# EAGLE design lighting_ctl_ft245 (EAGLE 5.12)
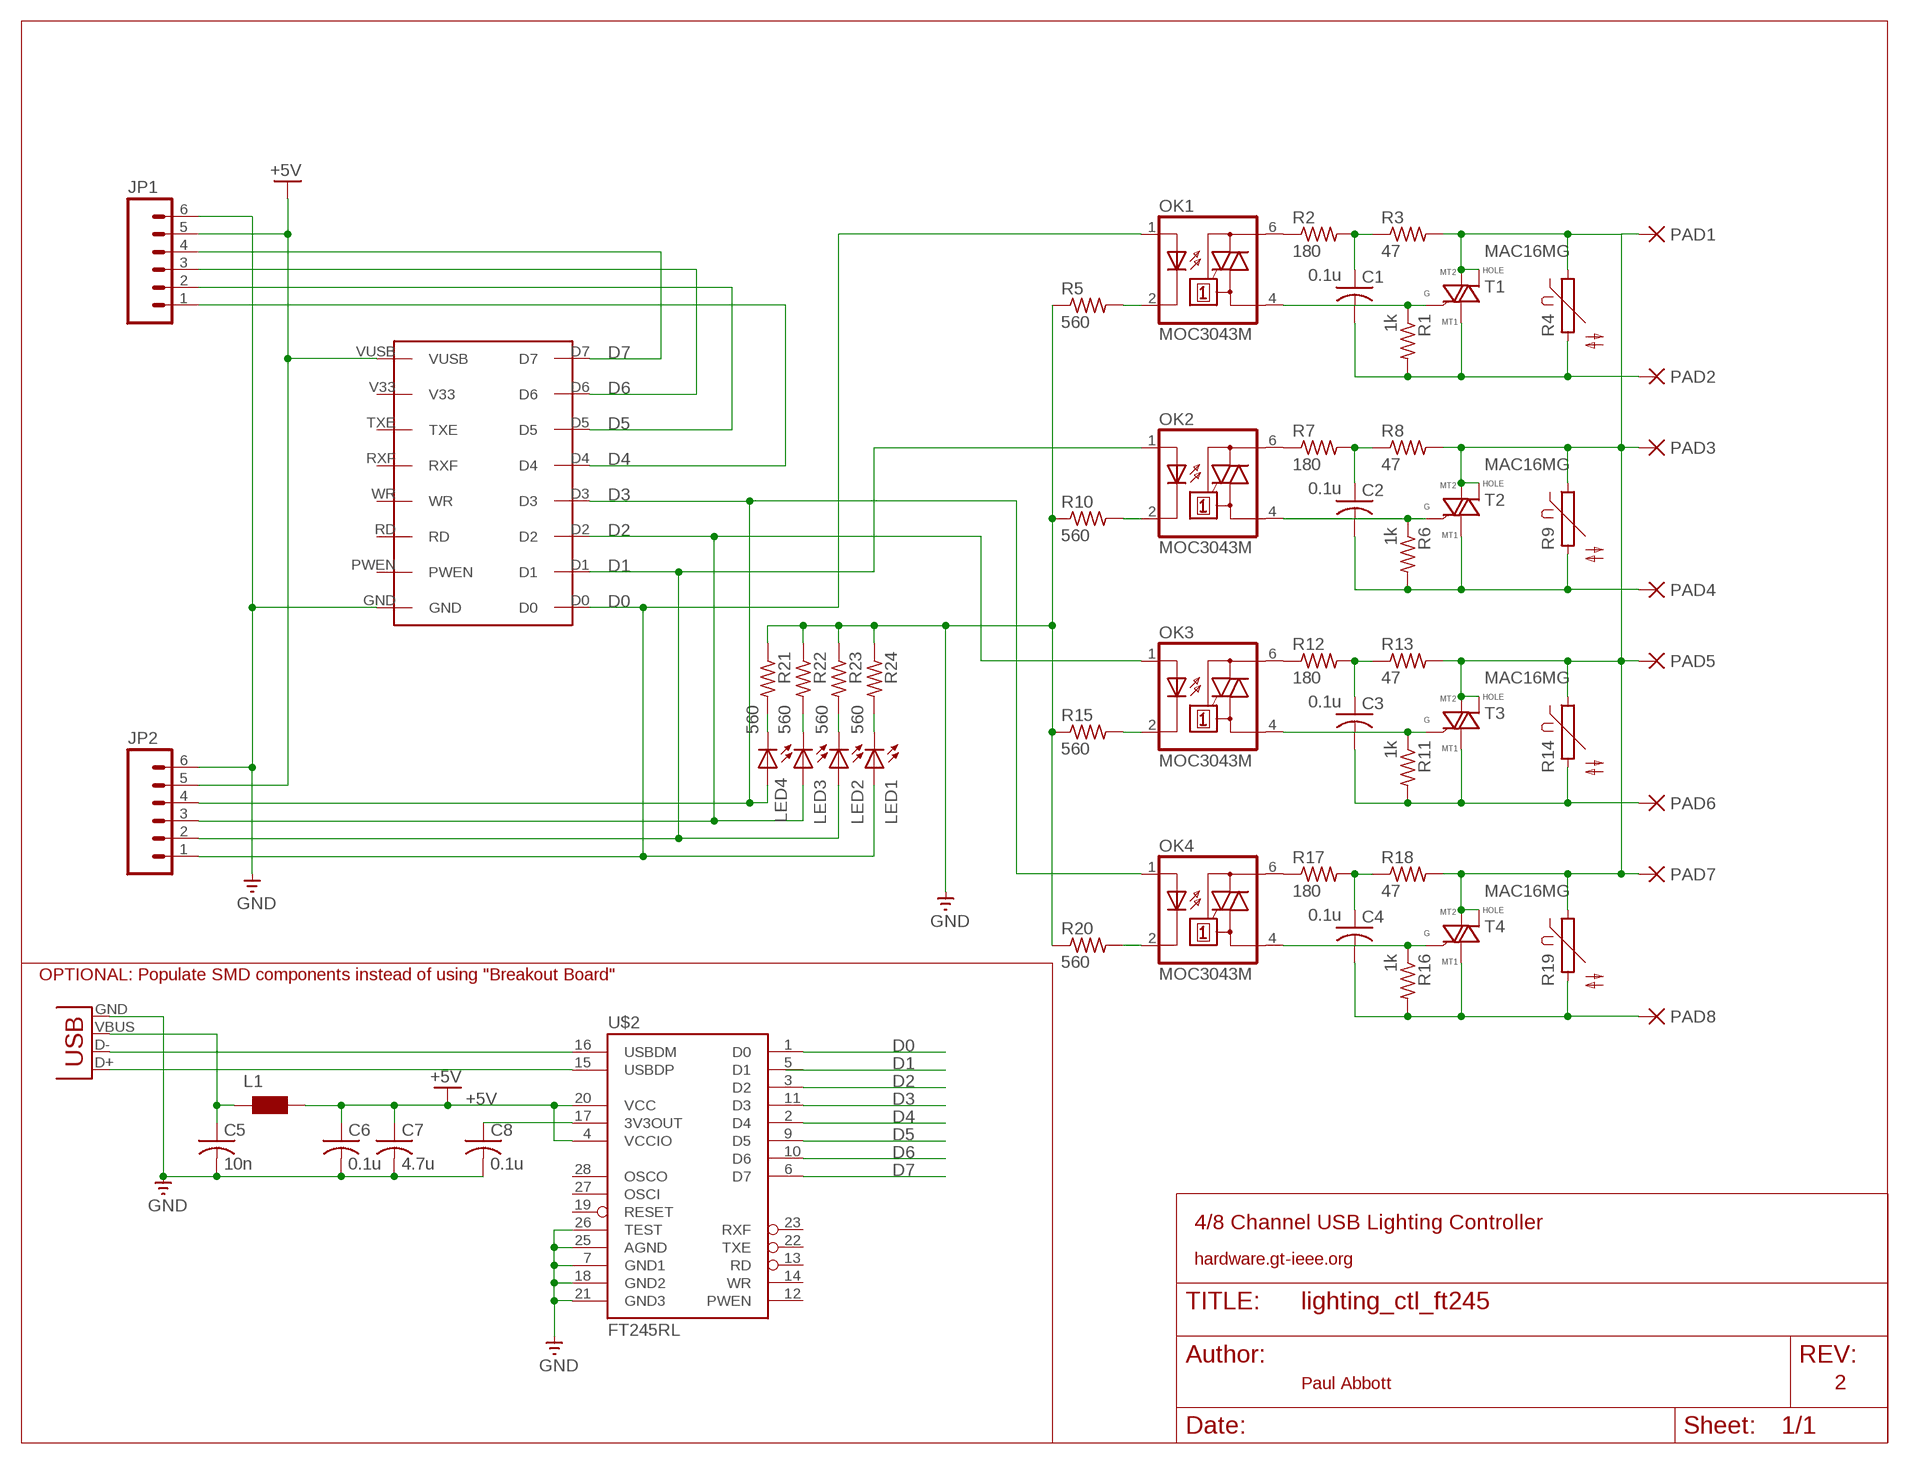
[diagram p0: schematic, sheet 1]

## Parts
C1  0.1u  C-US075-032X103  [C075-032X103]
C2  0.1u  C-US075-032X103  [C075-032X103]
C3  0.1u  C-US075-032X103  [C075-032X103]
C4  0.1u  C-US075-032X103  [C075-032X103]
C5  10n  C-USC0603  [C0603]
C6  0.1u  C-USC0603  [C0603]
C7  4.7u  C-USC1206  [C1206]
C8  0.1u  C-USC0603  [C0603]
FRAME2  LETTER_L  [LETTER_L]
JP1  M06LOCK  [1X06_LOCK]
JP2  M06LOCK  [1X06_LOCK]
L1  WE-CBF_0805  [0805]
LED1  LED3MM  [LED3MM]
LED2  LED3MM  [LED3MM]
LED3  LED3MM  [LED3MM]
LED4  LED3MM  [LED3MM]
OK1  MOC3043M  MOC3010M  [DIL06]
OK2  MOC3043M  MOC3010M  [DIL06]
OK3  MOC3043M  MOC3010M  [DIL06]
OK4  MOC3043M  MOC3010M  [DIL06]
PAD1  PAD-0820  [0820]
PAD2  PAD-0820  [0820]
PAD3  PAD-0820  [0820]
PAD4  PAD-0820  [0820]
PAD5  PAD-0820  [0820]
PAD6  PAD-0820  [0820]
PAD7  PAD-0820  [0820]
PAD8  PAD-0820  [0820]
R1  1k  R-US_0613/5V  [P0613V]
R2  180  R-US_0613/5V  [P0613V]
R3  47  R-US_0613/5V  [P0613V]
R4  P595  [P595]
R5  560  R-US_0613/5V  [P0613V]
R6  1k  R-US_0613/5V  [P0613V]
R7  180  R-US_0613/5V  [P0613V]
R8  47  R-US_0613/5V  [P0613V]
R9  P595  [P595]
R10  560  R-US_0613/5V  [P0613V]
R11  1k  R-US_0613/5V  [P0613V]
R12  180  R-US_0613/5V  [P0613V]
R13  47  R-US_0613/5V  [P0613V]
R14  P595  [P595]
R15  560  R-US_0613/5V  [P0613V]
R16  1k  R-US_0613/5V  [P0613V]
R17  180  R-US_0613/5V  [P0613V]
R18  47  R-US_0613/5V  [P0613V]
R19  P595  [P595]
R20  560  R-US_0613/5V  [P0613V]
R21  560  R-US_0613/5V  [P0613V]
R22  560  R-US_0613/5V  [P0613V]
R23  560  R-US_0613/5V  [P0613V]
R24  560  R-US_0613/5V  [P0613V]
T1  MAC16MG  BT138  [TO220BH]
T2  MAC16MG  BT138  [TO220BH]
T3  MAC16MG  BT138  [TO220BH]
T4  MAC16MG  BT138  [TO220BH]
U$1  FT245BREAKOUT  [FT245BREAKOUT]
U$2  FT245RL  [SSOP28DB]
X1  USBSMD  [USB-MINIB]

## Nets
+5V [5V]: C6.1 C7.1 JP1.5 JP2.5 L1.2 U$1.VUSB U$2.4(VCCIO) U$2.20(VCC)
D0 [data]: JP2.1 LED1.A OK1.1(A) U$1.D0 U$2.1(D0)
D1 [data]: JP2.2 LED2.A OK2.1(A) U$1.D1 U$2.5(D1)
D2 [data]: JP2.3 LED3.A OK3.1(A) U$1.D2 U$2.3(D2)
D3 [data]: JP2.4 LED4.A OK4.1(A) U$1.D3 U$2.11(D3)
D4 [data]: JP1.1 U$1.D4 U$2.2(D4)
D5 [data]: JP1.2 U$1.D5 U$2.9(D5)
D6 [data]: JP1.3 U$1.D6 U$2.10(D6)
D7 [data]: JP1.4 U$1.D7 U$2.6(D7)
GND [5V]: C5.2 C6.2 C7.2 C8.2 JP1.6 JP2.6 R5.1 R10.1 R15.1 R20.1 R21.1 R22.1 R23.1 R24.1 U$1.GND U$2.7(GND1) U$2.18(GND2) U$2.21(GND3) U$2.25(AGND) U$2.26(TEST) X1.GND
L1_COMM [power]: PAD1.P$1(P) PAD3.P$1(P) PAD5.P$1(P) PAD7.P$1(P) R3.2 R4.1 R8.2 R9.1 R13.2 R14.1 R18.2 R19.1 T1.HOLE T1.T2(A2) T2.HOLE T2.T2(A2) T3.HOLE T3.T2(A2) T4.HOLE T4.T2(A2)
N$1 [power]: C1.2 PAD2.P$1(P) R1.2 R4.2 T1.T1(A1)
N$2: OK1.4(A1) R1.1 T1.G
N$3: OK1.6(A2) R2.1
N$4 [power]: C2.2 PAD4.P$1(P) R6.2 R9.2 T2.T1(A1)
N$5 [data]: U$2.15(USBDP) X1.D+
N$6: C1.1 R2.2 R3.1
N$7 [data]: U$2.16(USBDM) X1.D-
N$8: OK1.2(C) R5.2
N$9: OK2.4(A1) R6.1 T2.G
N$10: OK2.6(A2) R7.1
N$11: LED1.K(C) R24.2
N$12: C2.1 R7.2 R8.1
N$13: OK2.2(C) R10.2
N$14: LED2.K(C) R23.2
N$15 [power]: C3.2 PAD6.P$1(P) R11.2 R14.2 T3.T1(A1)
N$16: OK3.4(A1) R11.1 T3.G
N$17: OK3.6(A2) R12.1
N$18: C8.1 U$2.17(3V3OUT)
N$19: C3.1 R12.2 R13.1
N$20: OK3.2(C) R15.2
N$21 [power]: C4.2 PAD8.P$1(P) R16.2 R19.2 T4.T1(A1)
N$22: OK4.4(A1) R16.1 T4.G
N$23: OK4.6(A2) R17.1
N$24: LED3.K(C) R22.2
N$25: C4.1 R17.2 R18.1
N$26: OK4.2(C) R20.2
N$27: LED4.K(C) R21.2
N$28 [5V]: C5.1 L1.1 X1.VBUS
Unconnected: U$1.PWEN U$1.RD U$1.RXF U$1.TXE U$1.V33 U$1.WR U$2.12(PWEN) U$2.13(RD) U$2.14(WR) U$2.19(RESET) U$2.22(TXE) U$2.23(RXF) U$2.27(OSCI) U$2.28(OSCO)

## Notes on the sheet
- OPTIONAL: Populate SMD components instead of using "Breakout Board"
- 4/8 Channel USB Lighting Controller
- hardware.gt-ieee.org
- Paul Abbott | 2

## Library data of the parts
C1-C8 = rcl:C-US: CAPACITOR, American symbol
FRAME2 = FRAME:LETTER_L: FRAME LETTER landscape
JP1 JP2 = SparkFun:M06: Header 6 Standard 6-pin 0.1" header. Use with straight break away headers (SKU : PRT-00116), right angle break away headers (PRT-00553), swiss pins (PRT-00743), machine pins (PRT-00117), and female headers (PRT-00115). Molex polarized connector foot print use with SKU : PRT-08094 with associated crimp pins and housings. NOTES ON THE VARIANTS LOCK and LOCK_LONGPADS... This footprint was designed to help hold the alignment of a through-hole component (i.e. 6-pin header) while soldering it into place. You may notice that each hole has been shifted either up or down by 0.005 of an inch from it's more standard position (which is a perfectly straight line). This slight alteration caused the pins (the squares in the middle) to touch the edges of the holes. Because they are alternating, it causes a "brace" to hold the component in place. 0.005 has proven to be the perfect amount of "off-center" position when using our standard breakaway headers. Although looks a little odd when you look at the bare footprint, once you have a header in there, the alteration is very hard to notice. Also, if you push a header all the way into place, it is covered up entirely on the bottom side. This idea of altering the position of holes to aid alignment will be further integrated into the Sparkfun Library for other footprints. It can help hold any component with 3 or more connection pins.
L1 = wuerth-elektronik:WE-CBF: SMD EMI Suppression Ferrite Beads - excellent anti-EMI properties - low DCR - impedances till 3000 ohms - rated current up to 6 A
LED1-LED4 = led:LED: LED OSRAM: - CHIPLED LG R971, LG N971, LY N971, LG Q971, LY Q971, LO R971, LY R971 LH N974, LH R974 LS Q976, LO Q976, LY Q976 LO Q996 - Hyper CHIPLED LW Q18S LB Q993, LB Q99A, LB R99A - SideLED LS A670, LO A670, LY A670, LG A670, LP A670 LB A673, LV A673, LT A673, LW A673 LH A674 LY A675 LS A676, LA A676, LO A676, LY A676, LW A676 LS A679, LY A679, LG A679 - Hyper Micro SIDELED® LS Y876, LA Y876, LO Y876, LY Y876 LT Y87S - SmartLED LW L88C, LW L88S LB L89C, LB L89S, LG L890 LS L89K, LO L89K, LY L89K LS L896, LA L896, LO L896, LY L896 - TOPLED LS T670, LO T670, LY T670, LG T670, LP T670 LSG T670, LSP T670, LSY T670, LOP T670, LYG T670 LG T671, LOG T671, LSG T671 LB T673, LV T673, LT T673, LW T673 LH T674 LS T676, LA T676, LO T676, LY T676, LB T676, LH T676, LSB T676, LW T676 LB T67C, LV T67C, LT T67C, LS T67K, LO T67K, LY T67K, LW E67C LS E67B, LA E67B, LO E67B, LY E67B, LB E67C, LV E67C, LT E67C LW T67C LS T679, LY T679, LG T679 LS T770, LO T770, LY T770, LG T770, LP T770 LB T773, LV T773, LT T773, LW T773 LH T774 LS E675, LA E675, LY E675, LS T675 LS T776, LA T776, LO T776, LY T776, LB T776 LHGB T686 LT T68C, LB T68C - Hyper Mini TOPLED® LB M676 - Mini TOPLED Santana® LG M470 LS M47K, LO M47K, LY M47K Source: http://www.osram.convergy.de - LUMILED® LXK2-PW12-R00, LXK2-PW12-S00, LXK2-PW14-U00, LXK2-PW14-V00 LXK2-PM12-R00, LXK2-PM12-S00, LXK2-PM14-U00 LXK2-PE12-Q00, LXK2-PE12-R00, LXK2-PE12-S00, LXK2-PE14-T00, LXK2-PE14-U00 LXK2-PB12-K00, LXK2-PB12-L00, LXK2-PB12-M00, LXK2-PB14-N00, LXK2-PB14-P00, LXK2-PB14-Q00 LXK2-PR12-L00, LXK2-PR12-M00, LXK2-PR14-Q00, LXK2-PR14-R00 LXK2-PD12-Q00, LXK2-PD12-R00, LXK2-PD12-S00 LXK2-PH12-R00, LXK2-PH12-S00 LXK2-PL12-P00, LXK2-PL12-Q00, LXK2-PL12-R00 Source: www.luxeon.com
OK1-OK4 = optocoupler:MOC30*M: RANDOM-PHASE OPTOISOLATORS TRIAC DRIVER OUTPUT Source: http://www.fairchildsemi.com MOC3020-M.pdf
PAD1-PAD8 = dpads:PAD: WIRE PAD Standard US Drill Sizes and SMD pads
R1-R3 R5-R8 R10-R13 R15-R18 R20-R24 = rcl:R-US_: RESISTOR, American symbol
R4 R9 R14 R19 = varistor:P595: VARISTOR
T1-T4 = GT-IEEE:BT138: TRIAC Source: http://www.semiconductors.philips.com BT138_SERIES_2.pdf
U$1 = lighting_ctl_ft245:FT245BREAKOUT
U$2 = lighting_ctl_ft245:FT245RL: USB FIFO Controller 4th Generation USB Controller (USB <-> Parallel) - FIFO. Spark Fun Electronics SKU : COM-00787
X1 = lighting_ctl_ft245:USB: USB Connectors USB-B-PTH is fully proven SKU : PRT-00139 USB-miniB is fully proven SKU : PRT-00587 USB-A-PCB is untested. USB-A-H is throughly reviewed, but untested. Spark Fun Electronics SKU : PRT-00437 USB-B-SMT is throughly reviewed, but untested. Needs silkscreen touching up. USB-A-S has not been used/tested USB-MB-H has not been used/tested

## Net classes
0 default: width 0.406 mm, drill 0.584 mm, clearance 0.406 mm
1 power: width 0.813 mm, drill 0.584 mm, clearance 0.61 mm
2 data: width 0.254 mm, drill 0.381 mm, clearance 0.254 mm
3 5V: width 0.305 mm, drill 0.584 mm, clearance 0.305 mm

## Board
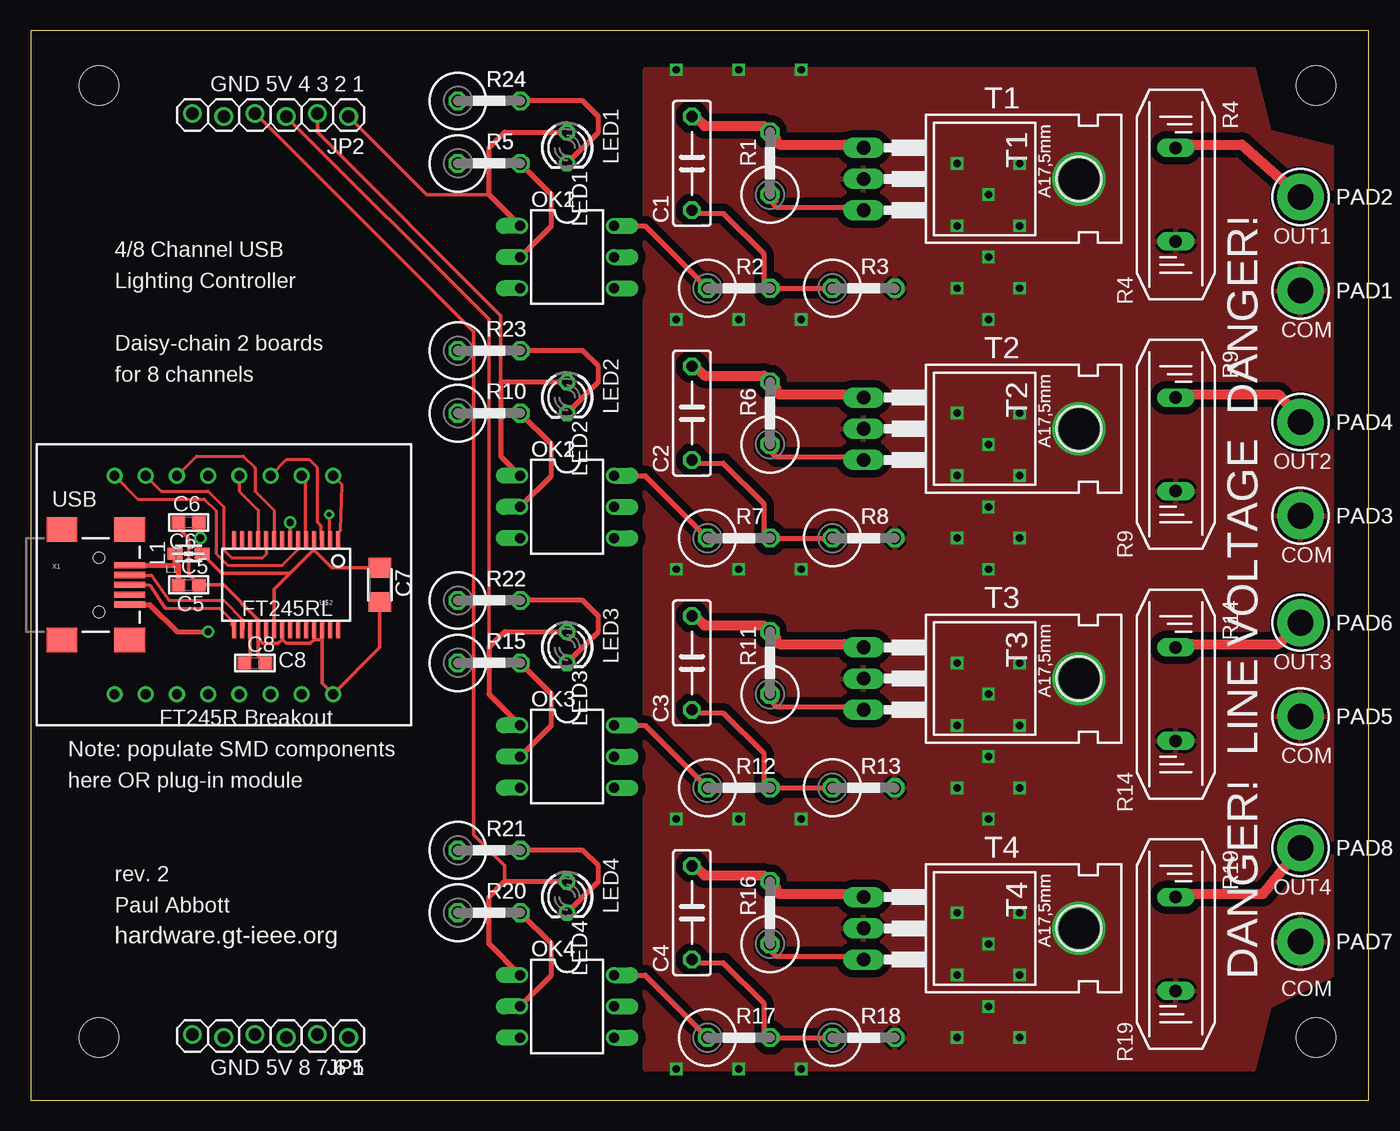
[diagram p1: board, top side]
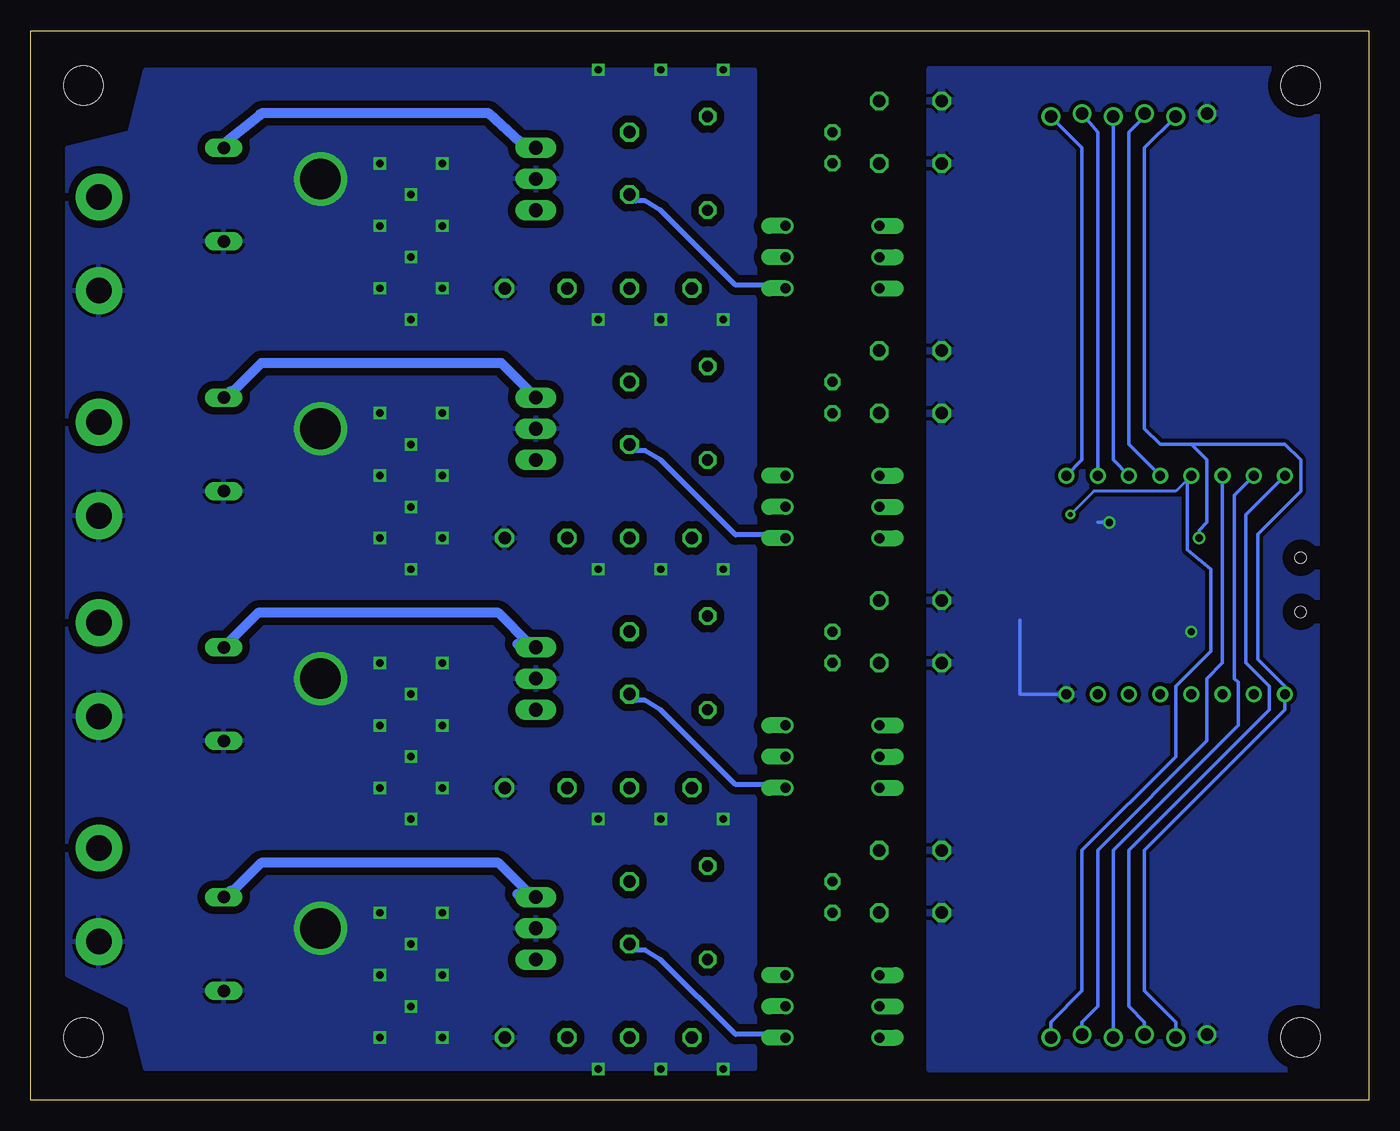
[diagram p2: board, bottom side, seen from below]

Size 108.89 x 86.99 mm. Coordinates in mm from the lower left corner, seen from the top.
Outline: 0,0 108.89,0 108.89,86.99 0,86.99 0,0
Copper layers (1*16): Top 0.035mm / dielectric 1.5mm / Bottom 0.035mm
Design rules "default": minimum track width 10mil, minimum drill 24mil, track to track 8mil, track to pad 8mil, pad to pad 8mil, via to via 8mil, smd to smd 8mil, copper to edge 40mil, drill to drill 8mil, minimum pad ring 10mil, minimum via ring 8mil, stop-mask expansion 4mil, vias tented up to drill 0mil, thermal gap 10mil
Holes 3.2 mm at 104.61,82.55 104.61,5.08 5.55,5.08 5.55,82.55

### Footprints (pad centres in the part's own frame; a part is rotated, then mirrored left to right if it is on the bottom)
C075-032X103 = drill 0.914 octagon: 1 -3.81,0; 2 3.81,0
C0603 = smd 1.1 x 1: 1 -0.85,0; 2 0.85,0
C1206 = smd 1.6 x 1.8: 1 -1.4,0; 2 1.4,0
1X06_LOCK = drill 1.016 round: 1 0,0; 2 2.54,-0.254; 3 5.08,0; 4 7.62,-0.254; 5 10.16,0; 6 12.7,-0.254
0805 = smd 1.2 x 1: 1 -1.1,0; 2 1.1,0
LED3MM = drill 0.813 octagon: A -1.27,0; K 1.27,0
DIL06 = drill 0.813 offset: 1 -2.54,-3.81; 2 0,-3.81; 3 2.54,-3.81; 4 2.54,3.81; 5 0,3.81; 6 -2.54,3.81
0820 = drill 2.083 pad 3.81 round: P$1 0,0
P0613V = drill 1.016 octagon: 1 -2.54,0; 2 2.54,0
P595 = drill 1.016 long: 1 0,3.81; 2 0,-3.81
TO220BH = drill 1.118 long: G 2.54,-6.35; T1 -2.54,-6.35; T2 0,-6.35 | drill 3.302 round: HOLE 0,11.176
FT245BREAKOUT = drill 0.8 round: D0 -8.89,-8.89; D1 -6.35,-8.89; D2 -3.81,-8.89; D3 -1.27,-8.89; D4 1.27,-8.89; D5 3.81,-8.89; D6 6.35,-8.89; D7 8.89,-8.89; GND -8.89,8.89; PWEN -6.35,8.89; RD -3.81,8.89; RXF 1.27,8.89; TXE 3.81,8.89; V33 6.35,8.89; VUSB 8.89,8.89; WR -1.27,8.89
SSOP28DB = smd 0.348 x 1.397: 1 -4.225,-3.656; 2 -3.575,-3.656; 3 -2.925,-3.656; 4 -2.275,-3.656; 5 -1.625,-3.656; 6 -0.975,-3.656; 7 -0.325,-3.656; 8 0.325,-3.656; 9 0.975,-3.656; 10 1.625,-3.656; 11 2.275,-3.656; 12 2.925,-3.656; 13 3.575,-3.656; 14 4.225,-3.656; 15 4.225,3.656; 16 3.575,3.656; 17 2.925,3.656; 18 2.275,3.656; 19 1.625,3.656; 20 0.975,3.656; 21 0.325,3.656; 22 -0.325,3.656; 23 -0.975,3.656; 24 -1.625,3.656; 25 -2.275,3.656; 26 -2.925,3.656; 27 -3.575,3.656; 28 -4.225,3.656
USB-MINIB = smd 2.5 x 0.5: D+ 2.5,0; D- 2.5,0.8; GND 2.5,-1.6; ID 2.5,-0.8; VBUS 2.5,1.6 | smd 2.5 x 2: GND@1 -3,-4.5; GND@2 -3,4.5; GND@3 2.5,4.5; GND@4 2.5,-4.5 | hole 0.9: 0,2.2; 0,-2.2

### Placement (x,y rotation side)
C1  53.81,76.2 90 top
C2  53.81,55.88 90 top
C3  53.81,35.56 90 top
C4  53.81,15.24 90 top
C5  12.85,41.91 0 top
C6  12.85,46.99 180 top
C7  28.41,41.91 270 top
C8  18.25,35.56 0 top
DRILEGEND  [DRILEGEND]  146.77,75.16 0 top  (outside the outline)
FRAME2  -33.82,-63.5 0 top  (outside the outline)
JP1  25.87,5.08 180 top
JP2  25.87,80.01 180 top
L1  12.85,44.45 0 top
LED1  43.65,77.47 270 top
LED2  43.65,57.15 270 top
LED3  43.65,36.83 270 top
LED4  43.65,16.51 270 top
OK1  43.65,68.58 270 top
OK2  43.65,48.26 270 top
OK3  43.65,27.94 270 top
OK4  43.65,7.62 270 top
PAD1  103.34,65.85 0 top
PAD2  103.34,73.47 0 top
PAD3  103.34,47.53 0 top
PAD4  103.34,55.15 0 top
PAD5  103.34,31.21 0 top
PAD6  103.34,38.83 0 top
PAD7  103.34,12.89 0 top
PAD8  103.34,20.51 0 top
R1  60.16,76.2 90 top
R2  57.62,66.04 0 top
R3  67.78,66.04 0 top
R4  93.18,73.66 180 top
R5  37.3,76.2 0 top
R6  60.16,55.88 90 top
R7  57.62,45.72 0 top
R8  67.78,45.72 0 top
R9  93.18,53.34 180 top
R10  37.3,55.88 0 top
R11  60.16,35.56 90 top
R12  57.62,25.4 0 top
R13  67.78,25.4 0 top
R14  93.18,33.02 180 top
R15  37.3,35.56 0 top
R16  60.16,15.24 90 top
R17  57.62,5.08 0 top
R18  67.78,5.08 0 top
R19  93.18,12.7 180 top
R20  37.3,15.24 0 top
R21  37.3,20.32 0 top
R22  37.3,40.64 0 top
R23  37.3,60.96 0 top
R24  37.3,81.28 0 top
T1  74.13,74.93 270 top
T2  74.13,54.61 270 top
T3  74.13,34.29 270 top
T4  74.13,13.97 270 top
U$1  15.71,41.91 180 top
U$2  20.79,41.91 180 top
X1  5.55,41.91 0 top

### Tracks (layer width: path | path; a pad name or v marks a point on that pad's centre or on a via)
+5V  (via drill 0.6)
  Top 0.305: C7.1 24.47,43.31 23.06,44.72 U$2.4 23.06,44.82 21.11,42.86 | 21.11,42.86 15.54,42.86 L1.2 | U$2.20 19.81,41.57 21.11,42.86 | v13.8,45.72 13.8,46.89 C6.1
  Top 0.406: L1.2 13.7,44.45 C6.1
  Bottom 0.305: JP2.5 18.25,77.47 18.25,54.61 16.98,53.34 14.44,53.34 | 14.44,53.34 13.17,52.07 13.17,46.99 13.8,46.35 v13.8,45.72 | JP1.5 15.71,6.35 18.25,8.89 18.25,20.32 6.82,31.75 U$1.VUSB 6.82,33.66 9.04,35.88 9.04,46.04 5.55,49.53 5.55,52.07 6.82,53.34 14.44,53.34
D0
  Top 0.254: U$2.1 25.01,46.13 25.23,46.35 25.33,50.07 U$1.D0
  Top 0.305: JP2.1 32.22,73.66 37.3,73.66
  Top 0.406: LED1.A 38.57,78.74 37.3,77.47 37.3,73.66 OK1.1
  Bottom 0.305: U$1.D0 23.33,52.07 23.33,77.47 JP2.1
D1
  Top 0.254: U$1.D1 22.38,50.48 22.38,45.6
  Top 0.305: U$2.5 22.38,45.6 | 38.25,58.42 38.25,63.82 23.33,78.74 JP2.2
  Top 0.406: LED2.A 38.25,58.42 38.25,52.39 OK2.1
  Bottom 0.305: 22.38,50.48 U$1.D1 22.06,78.74 JP2.2
D2
  Top 0.254: U$1.D2 20.79,52.07 22.69,52.07 23.33,51.44 23.33,46.99 23.65,46.67 23.65,45.63
  Top 0.305: U$2.3 23.65,45.63 | JP2.3 37.3,63.5 37.3,36.83
  Top 0.406: OK3.1 37.3,33.02 37.3,36.83 38.57,38.1 LED3.A
  Bottom 0.305: JP2.3 20.79,52.07 U$1.D2
D3
  Top 0.254: U$2.11 18.51,47.99 16.98,49.53 U$1.D3
  Top 0.305: JP2.4 36.03,62.48 36.03,21.59 38.57,19.05 38.57,17.78
  Top 0.406: OK4.1 37.3,12.7 37.3,16.51 38.57,17.78 LED4.A
  Bottom 0.305: U$1.D3 19.52,53.34 19.52,78.74 18.25,80.01 JP2.4
D4  (via drill 0.38)
  Top 0.254: v24.28,47.62 24.28,45.65 U$2.2
  Bottom 0.254: U$1.D4 15.71,49.53 22.38,49.53 v24.28,47.62
  Bottom 0.305: JP1.1 25.87,6.35 23.33,8.89 23.33,20.32 15.71,27.94 15.71,33.66 12.85,36.51 12.85,43.18 14.76,44.77 14.76,50.48 U$1.D4
D5
  Top 0.254: U$2.9 19.81,47.97 18.25,49.53 18.25,51.44 17.3,52.39 13.49,52.39 U$1.D5
  Top 0.406: JP1.2 23.33,5.08
  Bottom 0.305: JP1.2 23.33,6.35 22.06,7.62 22.06,20.32 13.17,29.21 13.17,34.29 11.9,35.56 U$1.D5
D6
  Top 0.254: U$1.D6 10.63,49.53 14.44,49.53 15.71,48.26 15.71,44.77 16.34,44.13 18.88,44.13 19.2,44.45 19.2,45.53
  Top 0.305: 19.2,45.53 U$2.10
  Bottom 0.305: JP1.3 20.79,20.32 10.63,30.48 10.63,33.97 10.95,34.29 10.95,49.21 U$1.D6
D7
  Top 0.254: U$1.D7 8.72,48.9 14.12,48.9 15.08,47.94 15.08,44.45 16.03,43.5 20.47,43.5 21.76,44.79 U$2.6
  Bottom 0.305: JP1.4 18.25,6.35 19.52,7.62 19.52,20.32 8.09,31.75 8.09,33.66 10,35.56 10,47.62 U$1.D7
GND  (via drill 0.6)
  Top 0.305: C6.2 12,46.57 12.85,45.72 12.85,42.76 C5.2 15.71,41.91 18.57,39.05 18.57,38.31 | 18.57,38.31 U$2.18 18.51,36.15 C8.2 | 23.01,38.31 U$2.25 23.06,37.47 | 23.71,37.47 23.71,33.91 U$1.GND 28.41,36.83 C7.2 | 23.71,37.47 U$2.26 | 23.06,37.47 23.71,37.47 | 18.57,38.31 18.57,37.47 18.88,37.15 20.15,37.15 20.47,37.47 U$2.21 20.46,37.47 20.79,37.15 22.75,37.15 23.06,37.47 | U$2.7 v21.11,46.98 v21.11,46.99
  Top 0.406: X1.GND 9.69,40.31 11.9,38.1 v14.44,38.1
  Bottom 0.305: 28.41,39.05 28.41,33.02 U$1.GND | v21.11,46.99 22.06,46.99
  pour Bottom: 35.71,83.82 4.28,83.82 4.28,2.54 35.71,2.54
L1_COMM  (via drill 0.6)
  other vias: 52.54,63.5 57.62,63.5 52.54,83.82 57.62,83.82 62.7,83.82 75.4,76.2 80.48,76.2 77.94,73.66 75.4,71.12 80.48,71.12 75.4,66.04 80.48,66.04 77.94,63.5 62.7,63.5 52.54,43.18 57.62,43.18 62.7,43.18 52.54,22.86 57.62,22.86 62.7,22.86 52.54,2.54 57.62,2.54 62.7,2.54 75.4,55.88 80.48,55.88 77.94,53.34 75.4,50.8 80.48,50.8 77.94,48.26 75.4,45.72 80.48,45.72 77.94,43.18 75.4,35.56 77.94,68.58 80.48,35.56 77.94,33.02 77.94,27.94 80.48,30.48 75.4,30.48 75.4,25.4 80.48,25.4 77.94,22.86 77.94,12.7 80.48,15.24 75.4,15.24 75.4,10.16 80.48,10.16 77.94,7.62 80.48,5.08 75.4,5.08
  pour Bottom: 50,83.82 50,2.54 99.53,2.54 100.8,7.62 105.88,10.16 105.88,77.47 100.8,78.74 99.53,83.82
  pour Top: 50,83.82 50,2.54 99.53,2.54 100.8,7.62 105.88,10.16 105.88,77.47 100.8,78.74 99.53,83.82
N$1
  Top 0.813: C1.2 54.32,79.76 54.83,79.25 59.65,79.25 R1.2 60.67,78.23 60.41,78.23 60.92,77.72 66.26,77.72 T1.T1 | R4.2 94.45,77.72 98.56,77.72 PAD2.P$1
  Bottom 0.813: T1.T1 69.05,77.98 71.59,80.26 90.13,80.26 90.39,80.01 92.93,77.98 R4.2
N$2
  Top 0.406: T1.G 66.26,72.64 60.67,72.64 60.16,73.15 60.67,73.15 R1.1
  Bottom 0.406: OK1.4 49.24,66.29 51.52,66.29 57.62,72.39 58.89,73.15 59.65,73.15 R1.1
N$3
  Top 0.406: OK1.6 50,71.12 R2.1
N$4
  Top 0.813: C2.2 54.32,59.44 54.83,58.93 59.65,58.93 R6.2 60.67,57.91 60.41,57.91 60.92,57.4 66.26,57.4 T2.T1 | R9.2 94.45,57.4 101.56,57.4 PAD4.P$1
  Bottom 0.813: T2.T1 70.57,59.94 90.13,59.94 92.42,57.66 92.67,57.66 R9.2
N$5
  Top 0.254: X1.D+ 9.68,41.91 10.95,40.01 15.39,40.01 16.34,39.05 16.34,38.67 U$2.15
N$6
  Top 0.406: C1.1 54.32,72.14 56.35,72.14 59.65,68.83 59.65,66.55 R2.2 R3.1
N$7
  Top 0.254: X1.D- 9.83,42.71 11.27,40.64 15.71,40.64 17.3,39.05 17.3,38.34 U$2.16
N$8
  Top 0.406: OK1.2 42.38,71.12 42.38,73.66 R5.2
N$9
  Top 0.406: T2.G 66.26,52.32 60.67,52.32 60.16,52.83 60.67,52.83 R6.1
  Bottom 0.406: OK2.4 49.24,45.97 51.52,45.97 57.62,52.07 58.89,52.83 59.65,52.83 R6.1
N$10
  Top 0.406: OK2.6 50,50.8 R7.1
N$11
  Top 0.406: R24.2 44.92,81.28 46.19,80.01 46.19,78.74 LED1.K
N$12
  Top 0.406: C2.1 54.32,51.82 56.35,51.82 59.65,48.51 59.65,46.23 R7.2 R8.1
N$13
  Top 0.406: OK2.2 42.38,50.8 42.38,53.34 R10.2
N$14
  Top 0.406: R23.2 44.92,60.96 46.19,59.69 46.19,58.42 LED2.K
N$15
  Top 0.813: C3.2 54.32,39.12 54.83,38.61 59.65,38.61 R11.2 60.67,37.59 60.41,37.59 60.92,37.08 66.26,37.08 T3.T1 | R14.2 94.45,37.08 101.56,37.08 PAD6.P$1
  Bottom 0.813: T3.T1 69.3,37.08 68.29,37.08 70.83,39.62 90.39,39.62 R14.2
N$16
  Top 0.406: T3.G 66.26,32 60.67,32 60.16,32.51 60.67,32.51 R11.1
  Bottom 0.406: OK3.4 49.24,25.65 51.52,25.65 57.62,31.75 58.89,32.51 59.65,32.51 R11.1
N$17
  Top 0.406: OK3.6 50,30.48 R12.1
N$18
  Top 0.305: U$2.17 17.86,36.02 C8.1
N$19
  Top 0.406: C3.1 54.32,31.5 56.35,31.5 59.65,28.19 59.65,25.91 R12.2 R13.1
N$20
  Top 0.406: R15.2 42.38,33.02 42.38,30.48 OK3.2
N$21
  Top 0.813: C4.2 54.32,18.8 54.83,18.29 59.65,18.29 R16.2 60.67,17.27 60.41,17.27 60.92,16.76 66.26,16.76 T4.T1 | R19.2 94.45,16.76 100.29,16.76 PAD8.P$1
  Bottom 0.813: T4.T1 69.3,16.76 68.29,16.76 70.83,19.3 90.13,19.3 92.42,17.02 92.67,17.02 R19.2
N$22
  Top 0.406: T4.G 66.26,11.68 60.67,11.68 60.16,12.19 60.67,12.19 R16.1
  Bottom 0.406: OK4.4 49.24,5.33 51.52,5.33 57.62,11.43 58.89,12.19 59.65,12.19 R16.1
N$23
  Top 0.406: OK4.6 50,10.16 R17.1
N$24
  Top 0.406: R22.2 44.92,40.64 46.19,39.37 46.19,38.1 LED3.K
N$25
  Top 0.406: C4.1 54.32,11.18 56.35,11.18 59.65,7.87 59.65,5.59 R17.2 R18.1
N$26
  Top 0.406: OK4.2 42.38,10.16 42.38,12.7 R20.2
N$27
  Top 0.406: LED4.K 46.19,17.78 46.19,19.05 44.92,20.32 R21.2
N$28
  Top 0.406: X1.VBUS 11.75,43.51 | 11.75,43.51 L1.1 | 11.75,43.51 12,43.51 C5.1

### Text on the board
Measures: 0.000 | 4.050 | 3.425 | 3.250 | 1.650 | MATERIAL: NEMA FR4 GLASS II. | BOARD: 0.062", 2 OZ COPPER. | SOLDERMASK: BOTH SIDES, GREEN. | SILKSCREEN: TOP, WHITE. | LAYERS: 2 - TOP & BOTTOM. | 0.200 | 0.000 | 0.000 | 0.000 | 0.069 | 0.000 | 0.000 | 0.150 | 0.550 | 0.750 | 4.219
Document: 4 Channel USB Lighting Controller | Paul Abbott | 2
_tsilk: GND 5V 4 3 2 1 | R24 | T1 | LED1 | R5 | R1 | OK2 | C1 | OUT1 | 4/8 Channel USB | R2 | R3 | R4 | Lighting Controller | R23 | T2 | COM | Daisy-chain 2 boards | LED2 | for 8 channels | R10 | R6 | OK1 | C2 | OUT2 | USB | C6 | R7 | R8 | R9 | COM | L1 | C7 | R22 | T3 | C5 | FT245RL | LED3 | R15 | C8 | R11 | OUT3 | OK3 | C3 | Note: populate SMD components | R12 | R13 | R14 | COM | here OR plug-in module | R21 | T4 | LED4 | rev. 2 | OUT4 | R20 | Paul Abbott | R16 | hardware.gt-ieee.org | OK4 | C4 | DANGER! LINE VOLTAGE DANGER! | COM | R17 | R18 | R19 | GND 5V 8 7 6 5
_tsilk2: R24 | R4 | T1 | A17,5mm | JP2 | R5 | LED1 | R1 | OK1 | PAD2 | C1 | R2 | R3 | PAD1 | R23 | R9 | A17,5mm | T2 | R10 | R6 | LED2 | PAD4 | OK2 | C2 | R7 | R8 | PAD3 | R22 | R14 | A17,5mm | T3 | PAD6 | R15 | LED3 | R11 | OK3 | C3 | PAD5 | R12 | R13 | R21 | R19 | PAD8 | T4 | A17,5mm | R20 | LED4 | R16 | OK4 | PAD7 | C4 | R17 | R18 | JP1